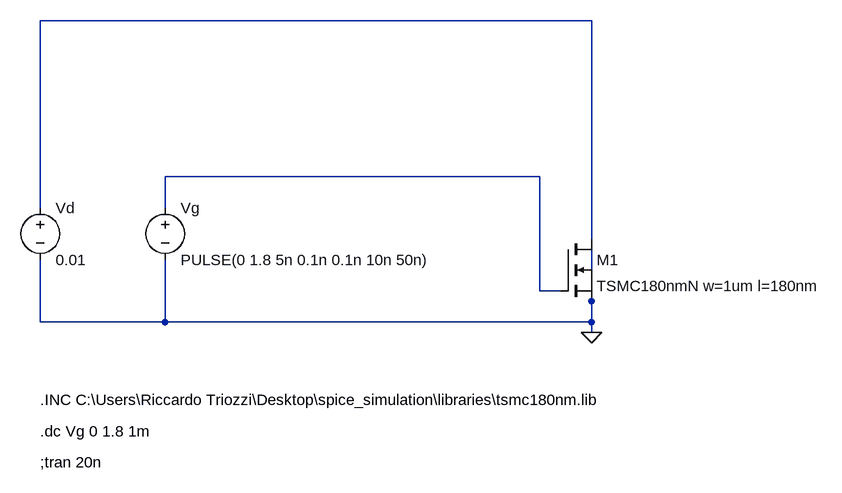
[diagram p0: schematic nmos.asc]
nmos.asc, the LTspice schematic file:
Version 4
SHEET 1 1180 680
WIRE 672 -192 -176 -192
WIRE 592 48 16 48
WIRE -176 96 -176 -192
WIRE 16 96 16 48
WIRE 672 144 672 -192
WIRE 592 224 592 48
WIRE 624 224 592 224
WIRE 672 240 672 160
WIRE -176 272 -176 176
WIRE 16 272 16 176
WIRE 16 272 -176 272
WIRE 672 272 672 240
WIRE 672 272 16 272
WIRE 672 288 672 272
FLAG 672 288 0
SYMBOL voltage 16 80 R0
WINDOW 123 0 0 Left 0
WINDOW 39 0 0 Left 0
SYMATTR InstName Vg
SYMATTR Value PULSE(0 1.8 5n 0.1n 0.1n 10n 50n)
SYMBOL voltage -176 80 R0
WINDOW 123 0 0 Left 0
WINDOW 39 0 0 Left 0
SYMATTR InstName Vd
SYMATTR Value 0.01
SYMBOL nmos 624 144 R0
SYMATTR InstName M1
SYMATTR Value TSMC180nmN w=1um l=180nm
TEXT -176 392 Left 2 !.INC C:\\Users\\Riccardo Triozzi\\Desktop\\spice_simulation\\libraries\\tsmc180nm.lib
TEXT -176 440 Left 2 !.dc Vg 0 1.8 1m
TEXT -176 488 Left 2 !;tran 20n

The netlist it stands for:
* nmos.asc
Vg N002 0 PULSE(0 1.8 5n 0.1n 0.1n 10n 50n)
Vd N001 0 0.01
M1 N001 N002 0 0 TSMC180nmN w=1um l=180nm
.model NMOS NMOS
.model PMOS PMOS
.lib standard.mos
.INC C:\Users\Riccardo Triozzi\Desktop\spice_simulation\libraries\tsmc180nm.lib
.dc Vg 0 1.8 1m
;tran 20n
.backanno
.end